# Altium project Diplom.PrjPcb
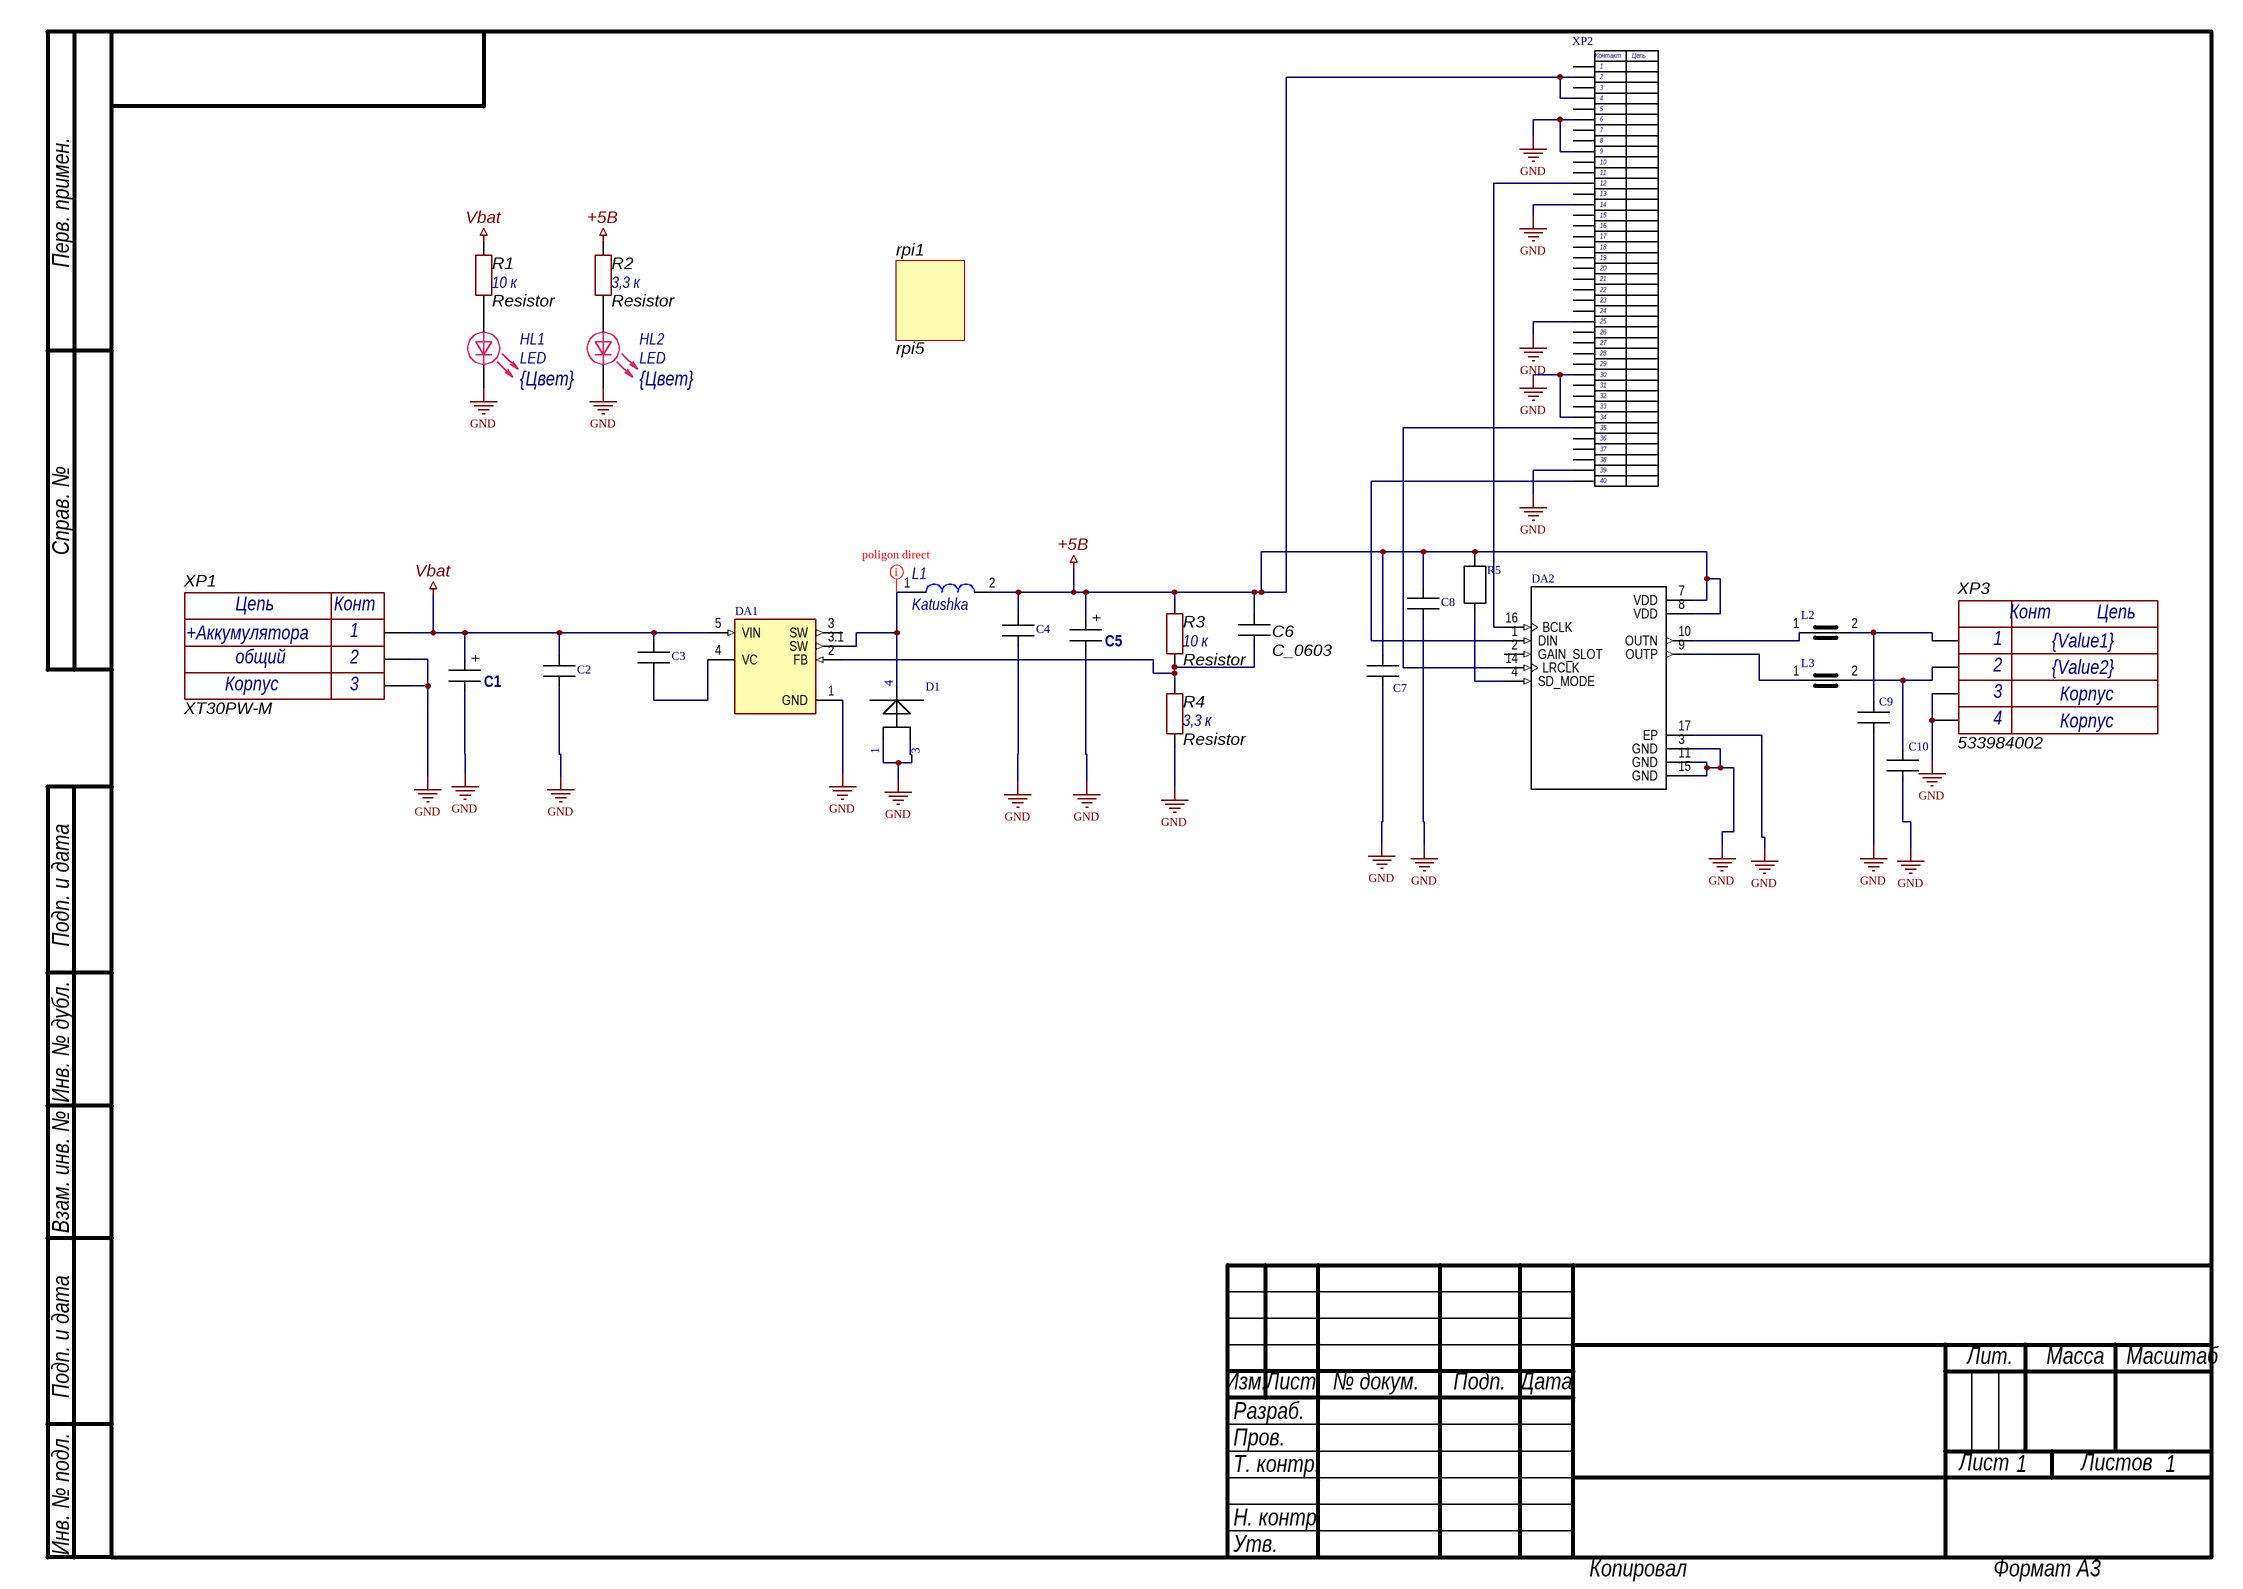
[diagram p0: Sheet1.SchDoc]
1 sheet, 27 parts. Net scope: global (net labels, ports and power ports of the same name join across sheets).
Board file: PCB1.PcbDoc

## Sheet Sheet1.SchDoc
size 420 x 297 mm; SheetNumber: 1; SheetTotal: 1

### Parts
C1  C Al SMD 220mcF  [ECAP 10-10]  (value not drawn)
C2  С_0.1uF  [CAP 0603 3D]  (value not drawn)
C3  С_0.1uF  [CAP 0603 3D]  (value not drawn)
C4  С_0.1uF  [CAP 0603 3D]  (value not drawn)
C5  C Al SMD 220mkf  [ECAP 10-10]  (value not drawn)
C6  С_0603  [CAP 0603 3D]
C7  С_0.1uF  [CAP 0603 3D]  (value not drawn)
C8  С_0.1uF  [CAP 0603 3D]  (value not drawn)
C9  С_220pF  [CAP 0603 3D]  (value not drawn)
C10  С_220pF  [CAP 0603 3D]  (value not drawn)
D1  LF33CDT  [DPACK]  (value not drawn)
DA1  XL4015  [CONV_XL4015]  (value not drawn)
DA2  MAX98357AETE+T  [QFN50P300X300X80-17N]  (value not drawn)
HL1  LED  Color: {Цвет}  [0805D]
HL2  LED  Color: {Цвет}  [0805D]
L1  Katushka  [Katushka]
L2  Z  [Ferrit_1210]  (value not drawn)
L3  Z  [Ferrit_1210]  (value not drawn)
R1  Resistor  value 10 к  [0603R]
R2  Resistor  value 3,3 к  [0603R]
R3  Resistor  value 10 к  [0603R]
R4  Resistor  value 3,3 к  [0603R]
R5  R_0603  [Res_0603 3D]  (value not drawn)
rpi1  rpi5  [rpi5]
XP1  XT30PW-M  Value3: Корпус  Value2: общий  Value1: +Аккумулятора  [XT30PW-M]
XP2  PBD_40  [PBD40_8.5]  (value not drawn)
XP3  533984002  Value3: Корпус  Value2: {Value2}  Value1: {Value1}  [Picoblade_533984002]

### Nets
+5В: C4.1(-) C5.2(+) C6.1(-) C7.1(-) C8.1(-) DA2.7(VDD) DA2.8(VDD) L1.2 R2.2 R3.2 R5.2 XP2.2 XP2.4
GND: C1.1(-) C2.2(+) C4.2(+) C5.1(-) C7.2(+) C8.2(+) C9.2(+) C10.2(+) D1.1 D1.3 DA1.1(GND) DA2.3(GND) DA2.11(GND) DA2.15(GND) DA2.17(EP) HL1.2 HL2.2 R4.1 XP1.0 XP1.N XP2.6 XP2.9 XP2.14 XP2.25 XP2.30 XP2.34 XP2.39 XP3.3 XP3.4
Vbat: C1.2(+) C2.1(-) C3.1(-) DA1.5(VIN) R1.2 XP1.P
NetC3_2: C3.2(+) DA1.4(VC)
NetC6_2: C6.2(+) DA1.2(FB) R3.1 R4.2
NetC9_1: C9.1(-) L2.2 XP3.1
NetC10_1: C10.1(-) L3.2 XP3.2
NetD1_4: D1.4(GND) DA1.3.1(SW) L1.1
NetDA2_1: DA2.1(DIN) XP2.40
NetDA2_4: DA2.4(SD_MODE) R5.1
NetDA2_9: DA2.9(OUTP) L3.1
NetDA2_10: DA2.10(OUTN) L2.1
NetDA2_14: DA2.14(LRCLK) XP2.35
NetDA2_16: DA2.16(BCLK) XP2.12
NetHL1_1: HL1.1 R1.1
NetHL2_1: HL2.1 R2.1

Not connected (* = marked no-connect by the designer): DA1 3(SW); DA2 2(GAIN_SLOT); XP2 1 3 5 7 8 10 11 13 15 16 17 18 19 20 21 22 23 24 26 27 28 29 31 32 33 36 37 38

### Layout directives
net class poligon direct: NetD1_4

### Notes on the sheet
- Перв. примен.
- Справ. №
- Подп. и дата
- Инв. № дубл.
- Взам. инв. №
- Разраб.
- Изм.
- Лист
- № докум.
- Подп.
- Дата
- Лит.
- Масса
- Масштаб
- Пров.
- Т. контр.
- Листов
- Инв. № подл.
- Н. контр.
- Утв.
- Копировал
- Формат А3
- (in symbol PBD_40) Контакт; Цепь
- (in symbol Picoblade_533984002) Конт; Цепь
- (in symbol XT30PW-M) Цепь; Конт; 1; 2; 3

### Library data of the parts
C1 C5 = C Al SMD: Конденсатор ECAP
C2-C4 C7 C8 = С_0603: 0.1мкФ
C6 = С_0603: Конденсатор керамика 0.33нФ
C9 C10 = С_0603
D1 = LF33CDT: Linear Voltage Regulator IC Positive Fixed 1 Output 500mA DPAK; MF: STMicroelectronics; SnapEDA_Link: https://www.snapeda.com/parts/LF33CDT/STMicroelectronics/view-part/?ref=snap; Package: TO-252 STMicroelectronics; Value: *; MP: LF33CDT; Check_prices: https://www.snapeda.com/parts/LF33CDT/STMicroelectronics/view-part/?ref=eda
DA1 = XL4015: 5A 180KHz 36V Buck DC to DC Converter; MF: XLSEMI; SnapEDA_Link: https://www.snapeda.com/parts/XL4015/XLSEMI/view-part/?ref=snap; Package: None; Value: *; MP: XL4015; Check_prices: https://www.snapeda.com/parts/XL4015/XLSEMI/view-part/?ref=eda
DA2 = MAX98357AETE+T: Tiny, Low-Cost, PCM Class D Amplifier with Class AB Performance; MF: Analog Devices; SnapEDA_Link: https://www.snapeda.com/parts/MAX98357AETE+T/Analog+Devices/view-part/?ref=snap; Package: TQFN-16 Maxim; Value: *; MP: MAX98357AETE+T; Check_prices: https://www.snapeda.com/parts/MAX98357AETE+T/Analog+Devices/view-part/?ref=eda
HL1 HL2 = LED: Светодиод; Part Number: LED
L2 L3 = Z: Феррит
R1 R3 = Resistor_10k_1_0603: Резистор номиналом 10 кОм и точностью 1%; Power: *; Part Number: Resistor_10k_1_0603; Tolerance: 1%
R2 R4 = Resistor_3.3k_1_0603: Резистор номиналом 3,3 кОм и точностью 1%; Power: *; Part Number: Resistor_3.3k_1_0603; Tolerance: 1%
XP1 = XT30PW-M: 30 А (15 продолжительно), 2 контакта разъем угловой отец; System: Connector; Part Number: XT30PW-M
XP3 = Picoblade_533984002: 2pin, 1.25mm, вилка, PicoBlade, на плату, SMT; Value4: Корпус; Part Number: Picoblade_533984002